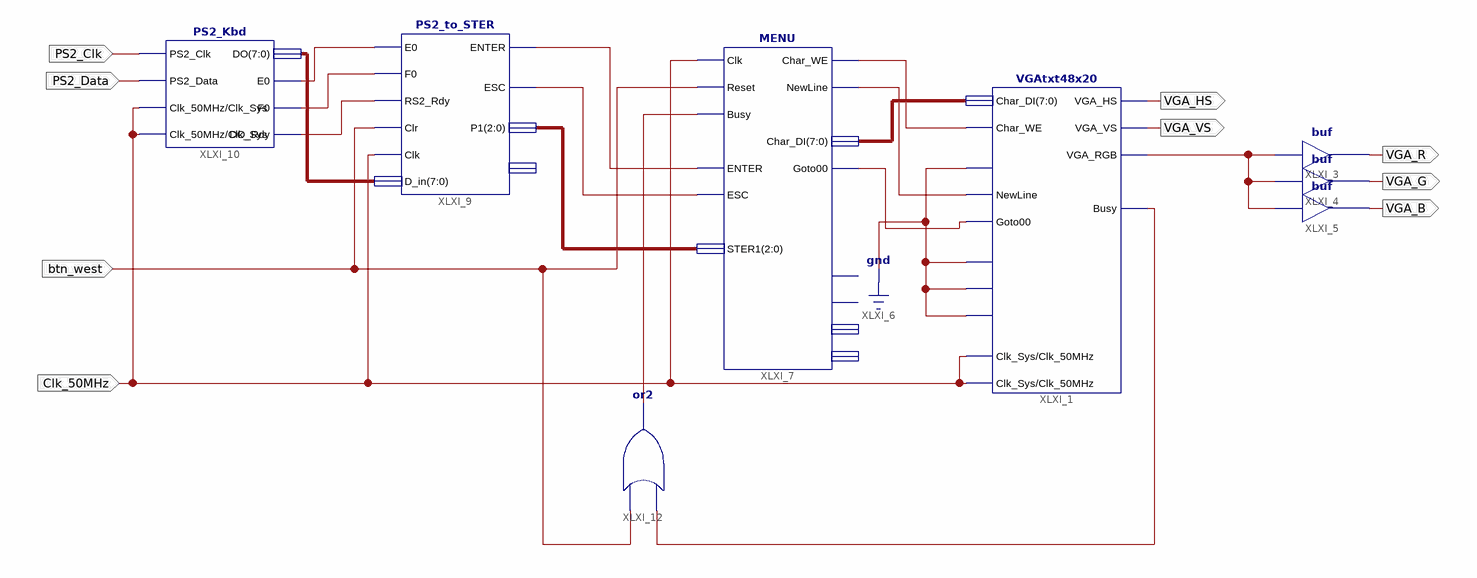
[diagram p0: schematic sheet 1]
// Xilinx ISE schematic Main.sch (spartan3e) as structural Verilog: 8 symbols, 9 ports
module Main (
  input  Clk_50MHz,
  input  btn_west,
  input  PS2_Clk,
  input  PS2_Data,
  output VGA_HS,
  output VGA_VS,
  output VGA_R,
  output VGA_G,
  output VGA_B
);

  wire XLXN_3, XLXN_11, XLXN_12, XLXN_16, XLXN_21, XLXN_38, XLXN_81, XLXN_82, XLXN_83, XLXN_120, XLXN_122;
  wire [2:0] XLXN_99;
  wire [7:0] XLXN_10, XLXN_98;

  VGAtxt48x20 XLXI_1 (
    .Char_DI(XLXN_10), .Home(1'b0), .NewLine(XLXN_12), .Goto00(XLXN_21), .Clk_Sys(Clk_50MHz),
    .Clk_50MHz(Clk_50MHz), .CursorOn(1'b0), .ScrollEn(1'b0), .ScrollClear(1'b0), .Busy(XLXN_122),
    .VGA_HS(VGA_HS), .VGA_VS(VGA_VS), .VGA_RGB(XLXN_3), .Char_WE(XLXN_11));
  buf XLXI_3 (VGA_R, XLXN_3);
  buf XLXI_4 (VGA_G, XLXN_3);
  buf XLXI_5 (VGA_B, XLXN_3);
  MENU XLXI_7 (
    .ENTER(XLXN_120), .ESC(XLXN_38), .Clk(Clk_50MHz), .Reset(btn_west), .Busy(XLXN_16), .STER1(XLXN_99),
    .Char_WE(XLXN_11), .NewLine(XLXN_12), .Goto00(XLXN_21), .Char_DI(XLXN_10));  // open: Play, Pouse, P1_RGB, P2_RGB
  PS2_to_STER XLXI_9 (
    .E0(XLXN_81), .F0(XLXN_82), .RS2_Rdy(XLXN_83), .Clr(btn_west), .Clk(Clk_50MHz), .D_in(XLXN_98),
    .ENTER(XLXN_120), .ESC(XLXN_38), .P1(XLXN_99));  // open: P2
  PS2_Kbd XLXI_10 (
    .PS2_Clk(PS2_Clk), .PS2_Data(PS2_Data), .Clk_50MHz(Clk_50MHz), .E0(XLXN_81), .F0(XLXN_82),
    .DO_Rdy(XLXN_83), .DO(XLXN_98), .Clk_Sys(Clk_50MHz));
  or XLXI_12 (XLXN_16, XLXN_122, btn_west);
endmodule
